# EAGLE design PowerSplitterLarge (EAGLE 8.4.3)
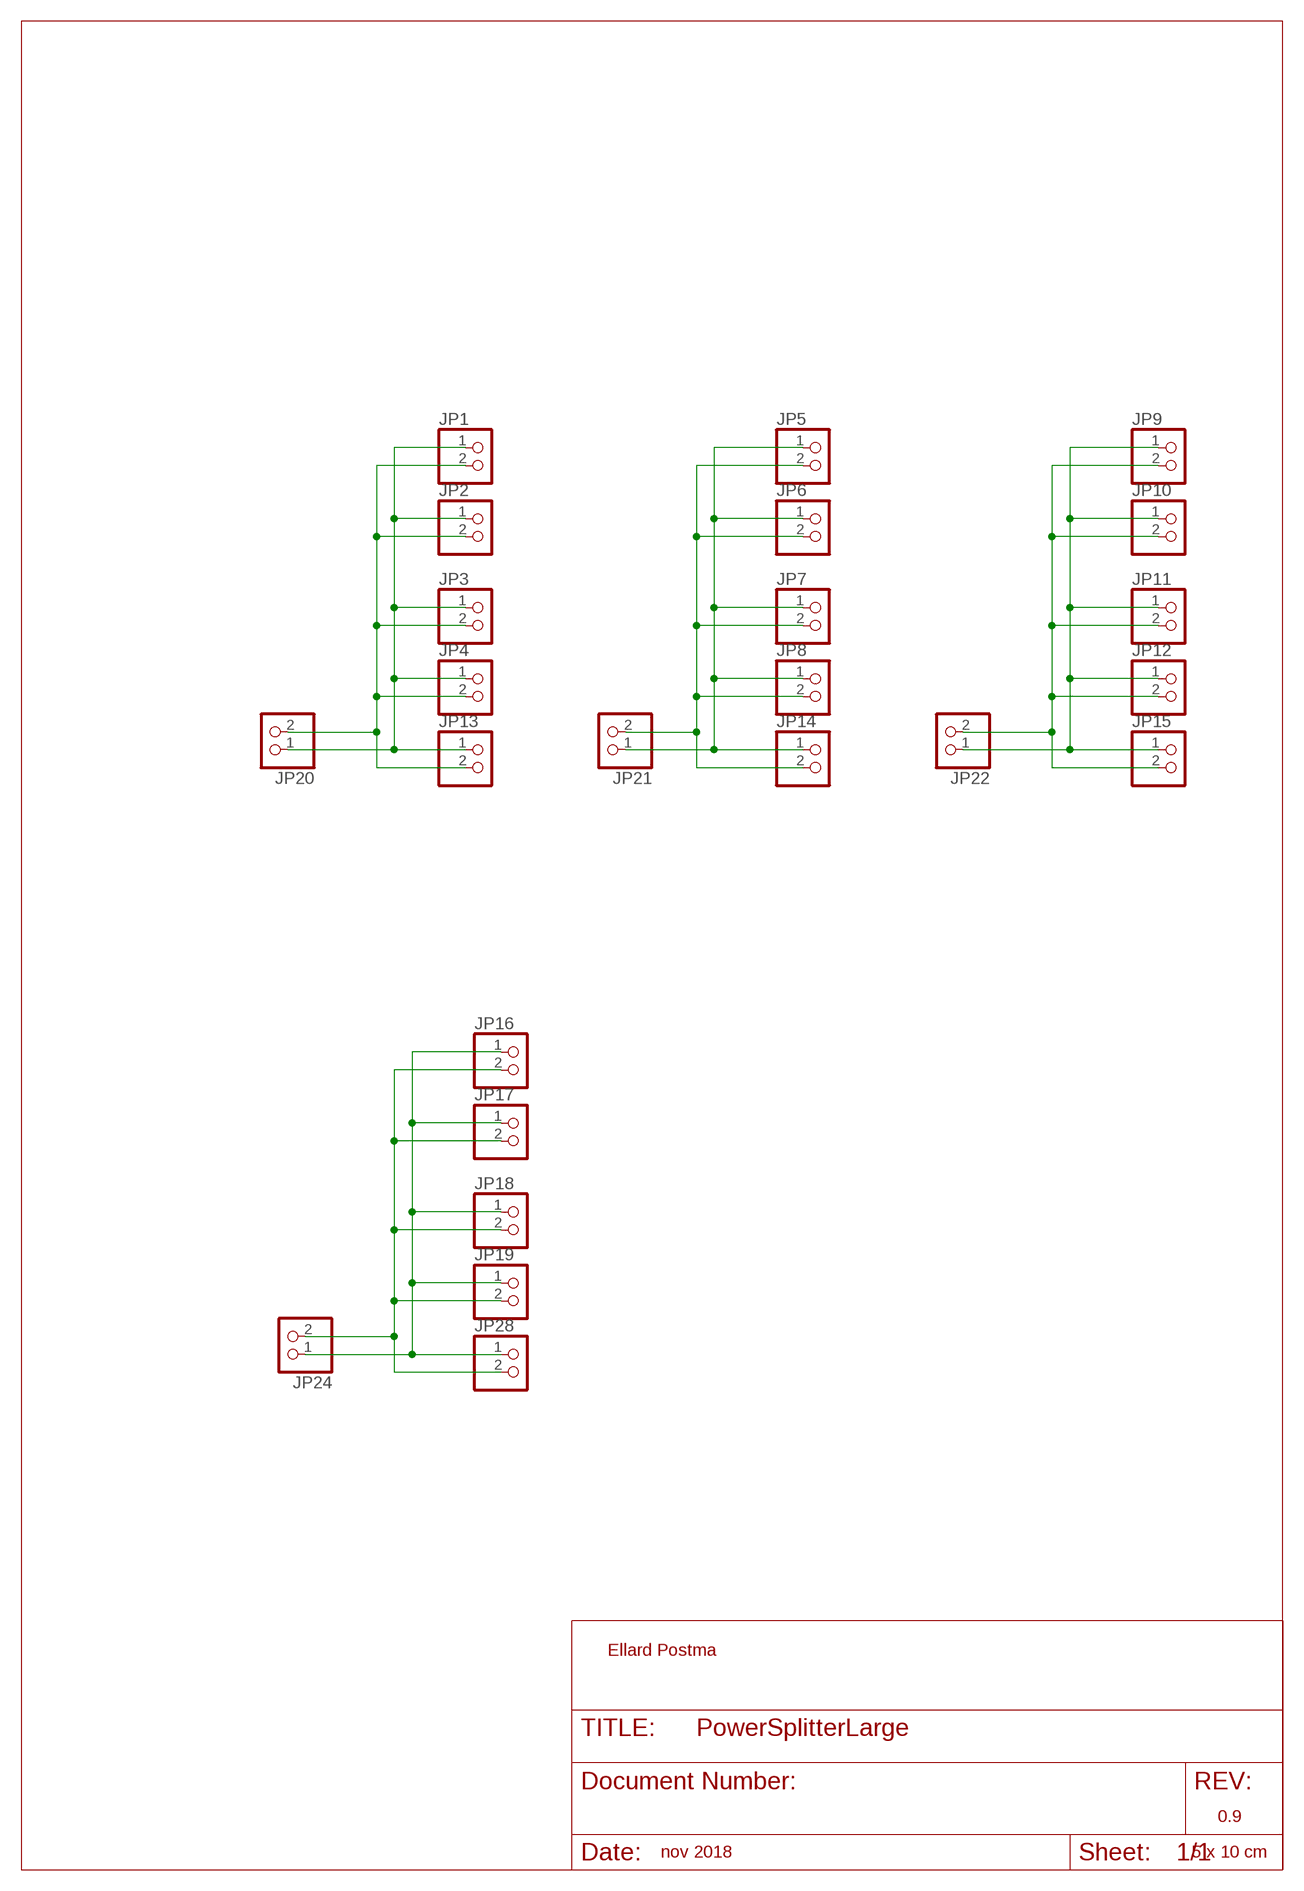
[diagram p0: schematic, sheet 1]

## Parts
JP1  PINHD-1X2/90  [1X02/90]
JP2  PINHD-1X2/90  [1X02/90]
JP3  PINHD-1X2/90  [1X02/90]
JP4  PINHD-1X2/90  [1X02/90]
JP5  PINHD-1X2/90  [1X02/90]
JP6  PINHD-1X2/90  [1X02/90]
JP7  PINHD-1X2/90  [1X02/90]
JP8  PINHD-1X2/90  [1X02/90]
JP9  PINHD-1X2/90  [1X02/90]
JP10  PINHD-1X2/90  [1X02/90]
JP11  PINHD-1X2/90  [1X02/90]
JP12  PINHD-1X2/90  [1X02/90]
JP13  PINHD-1X2/90  [1X02/90]
JP14  PINHD-1X2/90  [1X02/90]
JP15  PINHD-1X2/90  [1X02/90]
JP16  PINHD-1X2/90  [1X02/90]
JP17  PINHD-1X2/90  [1X02/90]
JP18  PINHD-1X2/90  [1X02/90]
JP19  PINHD-1X2/90  [1X02/90]
JP20  PINHD-1X2/90  [1X02/90]
JP21  PINHD-1X2/90  [1X02/90]
JP22  PINHD-1X2/90  [1X02/90]
JP24  PINHD-1X2/90  [1X02/90]
JP28  PINHD-1X2/90  [1X02/90]

## Nets
G1: JP1.2 JP2.2 JP3.2 JP4.2 JP13.2 JP20.2
G2: JP5.2 JP6.2 JP7.2 JP8.2 JP14.2 JP21.2
G3: JP9.2 JP10.2 JP11.2 JP12.2 JP15.2 JP22.2
G4: JP16.2 JP17.2 JP18.2 JP19.2 JP24.2 JP28.2
PLUS: JP1.1 JP2.1 JP3.1 JP4.1 JP13.1 JP20.1
PLUS2: JP5.1 JP6.1 JP7.1 JP8.1 JP14.1 JP21.1
PLUS3: JP9.1 JP10.1 JP11.1 JP12.1 JP15.1 JP22.1
PLUS4: JP16.1 JP17.1 JP18.1 JP19.1 JP24.1 JP28.1

## Notes on the sheet
- Ellard Postma
- 0.9
- nov 2018 | 5 x 10 cm

## Library data of the parts
JP1-JP22 JP24 JP28 = pinhead:PINHD-1X2: PIN HEADER

## Net classes
0 default: width 2.032 mm

## Board
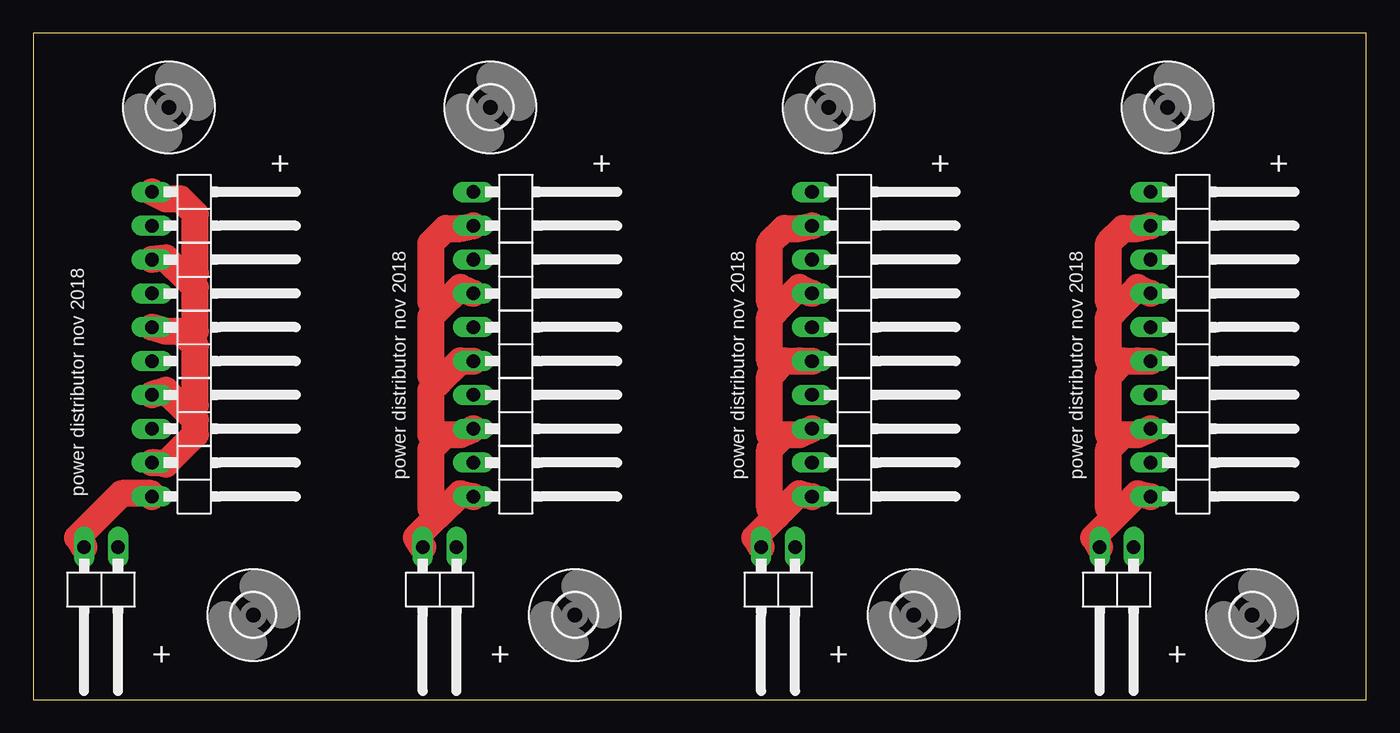
[diagram p1: board, top side]
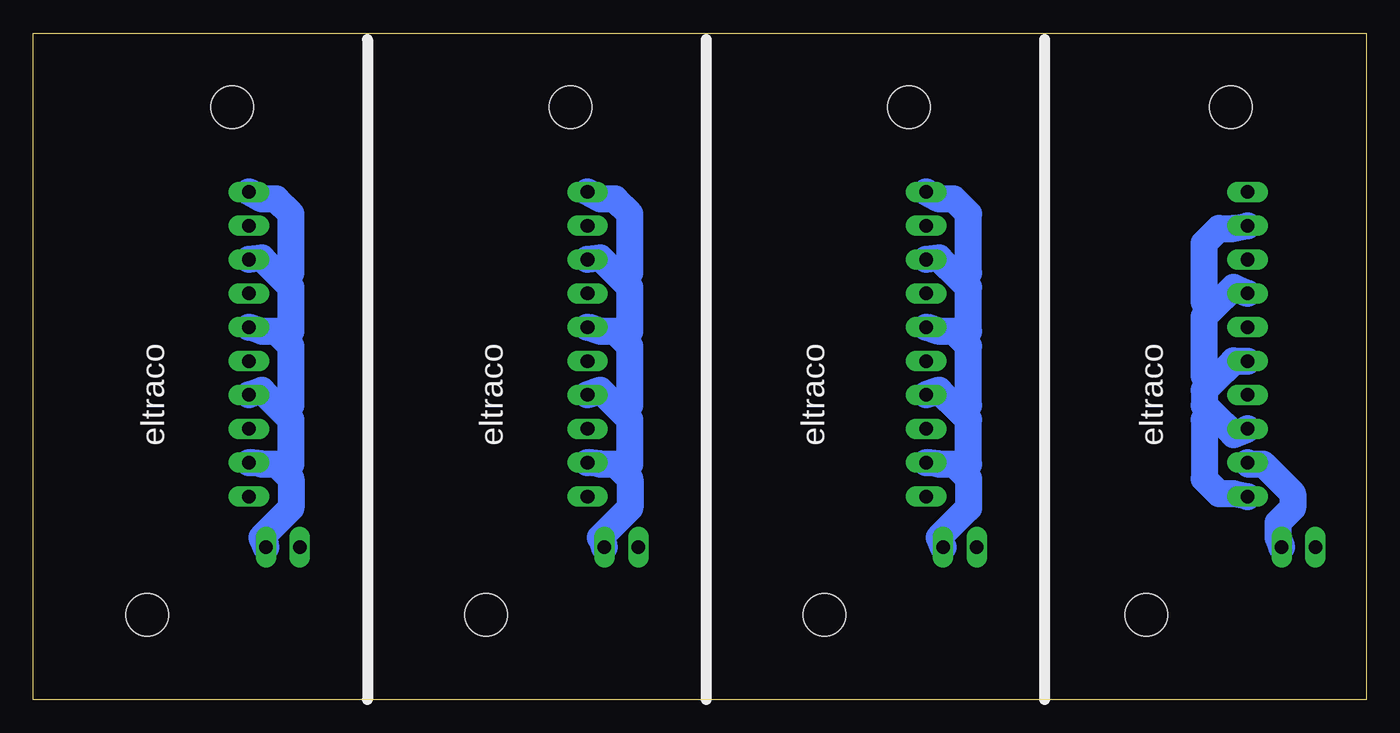
[diagram p2: board, bottom side, seen from below]

Size 100 x 50 mm. Coordinates in mm from the lower left corner, seen from the top.
Outline: 0,0 100,0 100,50 0,50 0,0
Copper layers (1*16): Top 0.035mm / dielectric 1.5mm / Bottom 0.035mm
Design rules "EagleRules": minimum track width 7mil, minimum drill 12mil, track to track 7mil, track to pad 7mil, pad to pad 7mil, via to via 7mil, smd to smd 0mil, copper to edge 20mil, drill to drill 10mil, minimum pad ring 10mil, minimum via ring 6mil, stop-mask expansion 2mil, vias tented up to drill 25mil, thermal gap 10mil

### Footprints (pad centres in the part's own frame; a part is rotated, then mirrored left to right if it is on the bottom)
1X02/90 = drill 1.016 long: 1 -1.27,-3.81; 2 1.27,-3.81
3,2 = hole 3.2: 0,0

### Placement (x,y rotation side)
JP1  12.7,36.83 270 top
JP2  12.7,31.75 270 top
JP3  12.7,26.67 270 top
JP4  12.7,21.59 270 top
JP5  36.83,36.83 270 top
JP6  36.83,31.75 270 top
JP7  36.83,26.67 270 top
JP8  36.83,21.59 270 top
JP9  62.23,36.83 270 top
JP10  62.23,31.75 270 top
JP11  62.23,26.67 270 top
JP12  62.23,21.59 270 top
JP13  12.7,16.51 270 top
JP14  36.83,16.51 270 top
JP15  62.23,16.51 270 top
JP16  87.63,26.67 270 top
JP17  87.63,31.75 270 top
JP18  87.63,16.51 270 top
JP19  87.63,21.59 270 top
JP20  5.08,7.62 180 top
JP21  30.48,7.62 180 top
JP22  55.88,7.62 180 top
JP24  81.28,7.62 180 top
JP28  87.63,36.83 270 top
U$1  [3,2]  10.16,44.45 0 top
U$2  [3,2]  34.29,44.45 0 top
U$3  [3,2]  59.69,44.45 0 top
U$4  [3,2]  85.09,44.45 0 top
U$5  [3,2]  91.44,6.35 0 top
U$6  [3,2]  66.04,6.35 0 top
U$7  [3,2]  40.64,6.35 0 top
U$8  [3,2]  16.51,6.35 0 top

### Tracks (layer width: path | path; a pad name or v marks a point on that pad's centre or on a via)
G1
  Top 2.032: JP20.2 3.31,12.15 6.63,15.47 8.84,15.47 JP13.2
  Bottom 2.032: 11.6,21.55 12.15,22.1 12.15,23.2 11.6,23.75 | 11.6,21.55 9.94,19.89 JP4.2 | 11.6,23.75 9.94,25.41 JP3.2 | 11.6,29.28 12.15,28.73 12.15,24.31 11.6,23.75 | 11.6,29.28 9.94,30.94 JP2.2 | JP1.2 9.94,35.36 11.05,35.36 12.15,34.25 12.15,29.83 11.6,29.28 | JP13.2 9.94,15.47 11.05,15.47 12.15,16.57 12.15,20.99 11.6,21.55
G2
  Top 2.032: 30.39,13.81 32.04,15.47 JP14.2 | 30.39,13.81 28.73,12.15 JP21.2 | 30.39,19.34 29.83,18.78 29.83,14.36 30.39,13.81 | 30.39,19.34 30.94,19.89 32.04,19.89 JP8.2 | 30.39,23.75 29.83,23.2 29.83,19.89 30.39,19.34 | 30.39,23.75 32.04,25.41 JP7.2 | 30.39,29.28 29.83,28.73 29.83,24.31 30.39,23.75 | 30.39,29.28 32.04,30.94 JP6.2 | JP5.2 32.04,35.36 30.94,35.36 29.83,34.25 29.83,29.83 30.39,29.28
G3
  Top 2.032: 55.8,13.81 57.45,15.47 JP15.2 | 55.8,13.81 54.14,12.15 JP22.2 | 55.8,19.34 55.24,18.78 55.24,14.36 55.8,13.81 | 55.8,19.34 56.35,19.89 57.45,19.89 JP12.2 | 55.8,24.86 55.24,24.31 55.24,19.89 55.8,19.34 | 55.8,24.86 56.35,25.41 57.45,25.41 JP11.2 | 55.8,29.28 55.24,28.73 55.24,25.41 55.8,24.86 | 55.8,29.28 57.45,30.94 JP10.2 | JP9.2 57.45,35.36 56.35,35.36 55.24,34.25 55.24,29.83 55.8,29.28
G4
  Top 2.032: 81.21,13.81 82.87,15.47 JP18.2 | 81.21,13.81 79.55,12.15 JP24.2 | 81.21,19.34 80.66,18.78 80.66,14.36 81.21,13.81 | 81.21,19.34 81.76,19.89 82.87,19.89 JP19.2 | 81.21,24.86 80.66,24.31 80.66,19.89 81.21,19.34 | 81.21,24.86 81.76,25.41 82.87,25.41 JP16.2 | 81.21,29.28 80.66,28.73 80.66,25.41 81.21,24.86 | 81.21,29.28 82.87,30.94 JP17.2 | JP28.2 82.87,35.36 81.76,35.36 80.66,34.25 80.66,29.83 81.21,29.28
PLUS
  Top 2.032: 11.6,21.55 12.15,20.99 12.15,19.89 9.94,17.68 JP13.1 | 11.6,21.55 9.94,23.2 JP4.1 | 11.6,27.07 12.15,26.52 12.15,22.1 11.6,21.55 | 11.6,27.07 11.05,27.62 9.94,27.62 JP3.1 | 11.6,31.49 12.15,30.94 12.15,27.62 11.6,27.07 | 11.6,31.49 9.94,33.15 JP2.1 | JP1.1 9.94,37.57 11.05,37.57 12.15,36.46 12.15,32.04 11.6,31.49
  Bottom 2.032: JP20.1 6.63,12.15 6.63,13.26 5.52,14.36 5.52,15.47 7.73,17.68 8.84,17.68 JP13.1
PLUS2
  Bottom 2.032: 30.39,17.13 30.94,17.68 32.04,17.68 JP14.1 | 30.39,17.13 29.83,16.57 29.83,14.36 32.04,12.15 JP21.1 | 30.39,21.55 29.83,20.99 29.83,17.68 30.39,17.13 | 30.39,21.55 32.04,23.2 JP8.1 | 30.39,27.07 29.83,26.52 29.83,22.1 30.39,21.55 | 30.39,27.07 30.94,27.62 32.04,27.62 JP7.1 | 30.39,31.49 29.83,30.94 29.83,27.62 30.39,27.07 | 30.39,31.49 32.04,33.15 JP6.1 | JP5.1 32.04,37.57 30.94,37.57 29.83,36.46 29.83,32.04 30.39,31.49
PLUS3
  Bottom 2.032: 55.8,17.13 56.35,17.68 57.45,17.68 JP15.1 | 55.8,17.13 55.24,16.57 55.24,14.36 57.45,12.15 JP22.1 | 55.8,21.55 55.24,20.99 55.24,17.68 55.8,17.13 | 55.8,21.55 57.45,23.2 JP12.1 | 55.8,27.07 55.24,26.52 55.24,22.1 55.8,21.55 | 55.8,27.07 56.35,27.62 57.45,27.62 JP11.1 | 55.8,31.49 55.24,30.94 55.24,27.62 55.8,27.07 | 55.8,31.49 57.45,33.15 JP10.1 | JP9.1 57.45,37.57 56.35,37.57 55.24,36.46 55.24,32.04 55.8,31.49
PLUS4
  Bottom 2.032: 81.21,17.13 81.76,17.68 82.87,17.68 JP18.1 | 81.21,17.13 80.66,16.57 80.66,14.36 82.87,12.15 JP24.1 | 81.21,21.55 80.66,20.99 80.66,17.68 81.21,17.13 | 81.21,21.55 82.87,23.2 JP19.1 | 81.21,27.07 80.66,26.52 80.66,22.1 81.21,21.55 | 81.21,27.07 81.76,27.62 82.87,27.62 JP16.1 | 81.21,31.49 80.66,30.94 80.66,27.62 81.21,27.07 | 81.21,31.49 82.87,33.15 JP17.1 | JP28.1 82.87,37.57 81.76,37.57 80.66,36.46 80.66,32.04 81.21,31.49

### Text on the board
tNames: + | + | + | + | power distributor nov 2018 | power distributor nov 2018 | power distributor nov 2018 | power distributor nov 2018 | + | + | + | +
bNames: eltraco | eltraco | eltraco | eltraco